# EAGLE design Infrarojo_01 (EAGLE 8.6.3)
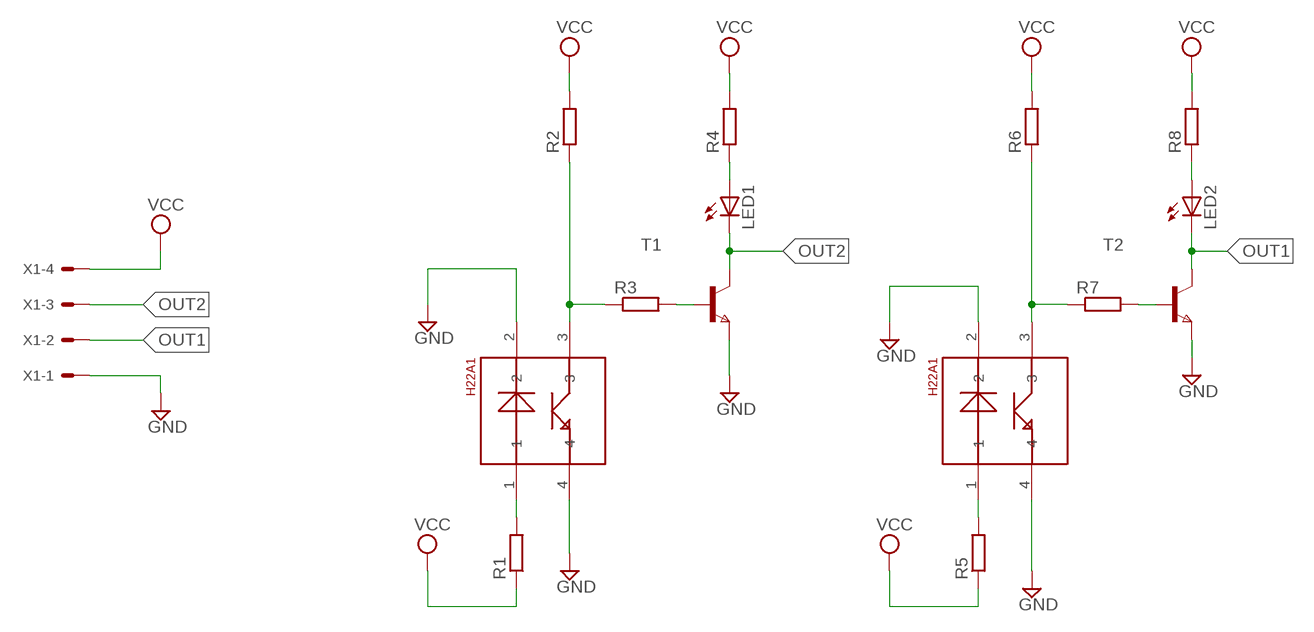
[diagram p0: schematic, sheet 1]

## Parts
IR1  IR1  H22A1  [H22A1]
IR2  IR2  H22A1  [H22A1]
LED1  LED3MM  [LED3MM]
LED2  LED3MM  [LED3MM]
R1  R-EU_R0805  [R0805]
R2  R-EU_R0805  [R0805]
R3  R-EU_R0805  [R0805]
R4  R-EU_R0805  [R0805]
R5  R-EU_R0805  [R0805]
R6  R-EU_R0805  [R0805]
R7  R-EU_R0805  [R0805]
R8  R-EU_R0805  [R0805]
T1  NPNSOT23  [SOT-23]
T2  NPNSOT23  [SOT-23]
X1  C-GRID-04-70543  [70543-04]

## Nets
GND: IR1.2 IR1.4 IR2.2 IR2.4 T1.2(E) T2.2(E) X1.1
N$1: IR1.1 R1.2
N$2: IR2.1 R5.2
N$3: IR1.3 R2.1 R3.1
N$4: R3.2 T1.3(B)
N$5: LED1.A R4.1
N$8: IR2.3 R6.1 R7.1
N$9: R7.2 T2.3(B)
N$11: LED2.A R8.1
OUT1: LED2.K(C) T2.1(C) X1.2
OUT2: LED1.K(C) T1.1(C) X1.3
VCC: R1.1 R2.2 R4.2 R5.1 R6.2 R8.2 X1.4

## Library data of the parts
IR1 IR2 = h22a1:H22A1
LED1 LED2 = led:LED: LED OSRAM: - CHIPLED LG R971, LG N971, LY N971, LG Q971, LY Q971, LO R971, LY R971 LH N974, LH R974 LS Q976, LO Q976, LY Q976 LO Q996 - Hyper CHIPLED LW Q18S LB Q993, LB Q99A, LB R99A - SideLED LS A670, LO A670, LY A670, LG A670, LP A670 LB A673, LV A673, LT A673, LW A673 LH A674 LY A675 LS A676, LA A676, LO A676, LY A676, LW A676 LS A679, LY A679, LG A679 - Hyper Micro SIDELED® LS Y876, LA Y876, LO Y876, LY Y876 LT Y87S - SmartLED LW L88C, LW L88S LB L89C, LB L89S, LG L890 LS L89K, LO L89K, LY L89K LS L896, LA L896, LO L896, LY L896 - TOPLED LS T670, LO T670, LY T670, LG T670, LP T670 LSG T670, LSP T670, LSY T670, LOP T670, LYG T670 LG T671, LOG T671, LSG T671 LB T673, LV T673, LT T673, LW T673 LH T674 LS T676, LA T676, LO T676, LY T676, LB T676, LH T676, LSB T676, LW T676 LB T67C, LV T67C, LT T67C, LS T67K, LO T67K, LY T67K, LW E67C LS E67B, LA E67B, LO E67B, LY E67B, LB E67C, LV E67C, LT E67C LW T67C LS T679, LY T679, LG T679 LS T770, LO T770, LY T770, LG T770, LP T770 LB T773, LV T773, LT T773, LW T773 LH T774 LS E675, LA E675, LY E675, LS T675 LS T776, LA T776, LO T776, LY T776, LB T776 LHGB T686 LT T68C, LB T68C - Hyper Mini TOPLED® LB M676 - Mini TOPLED Santana® LG M470 LS M47K, LO M47K, LY M47K Source: http://www.osram.convergy.de LUXEON: - LUMILED® LXK2-PW12-R00, LXK2-PW12-S00, LXK2-PW14-U00, LXK2-PW14-V00 LXK2-PM12-R00, LXK2-PM12-S00, LXK2-PM14-U00 LXK2-PE12-Q00, LXK2-PE12-R00, LXK2-PE12-S00, LXK2-PE14-T00, LXK2-PE14-U00 LXK2-PB12-K00, LXK2-PB12-L00, LXK2-PB12-M00, LXK2-PB14-N00, LXK2-PB14-P00, LXK2-PB14-Q00 LXK2-PR12-L00, LXK2-PR12-M00, LXK2-PR14-Q00, LXK2-PR14-R00 LXK2-PD12-Q00, LXK2-PD12-R00, LXK2-PD12-S00 LXK2-PH12-R00, LXK2-PH12-S00 LXK2-PL12-P00, LXK2-PL12-Q00, LXK2-PL12-R00 Source: www.luxeon.com KINGBRIGHT: KA-3528ASYC Source: www.kingbright.com
R1-R8 = rcl:R-EU_: RESISTOR, European symbol; SPICEPREFIX: R
T1 T2 = zetex:NPNSOT23: NPN TRANSISTOR; MPN: DSS20201L-7; OC_FARNELL: 1710688; OC_NEWARK: 25R4555
X1 = con-molex:C-GRID-04: CONNECTOR wire to board 2.54 mm (0.100") pitch header; MF: MOLEX; OC_FARNELL: unknown; OC_NEWARK: unknown

## Board
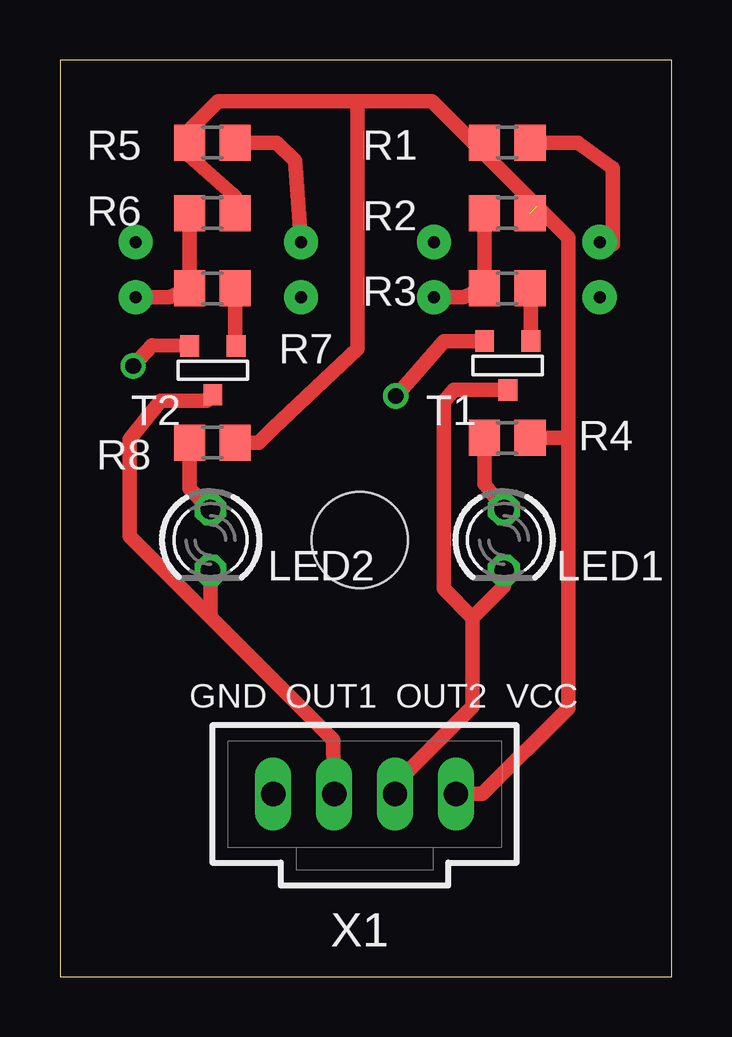
[diagram p1: board, top side]
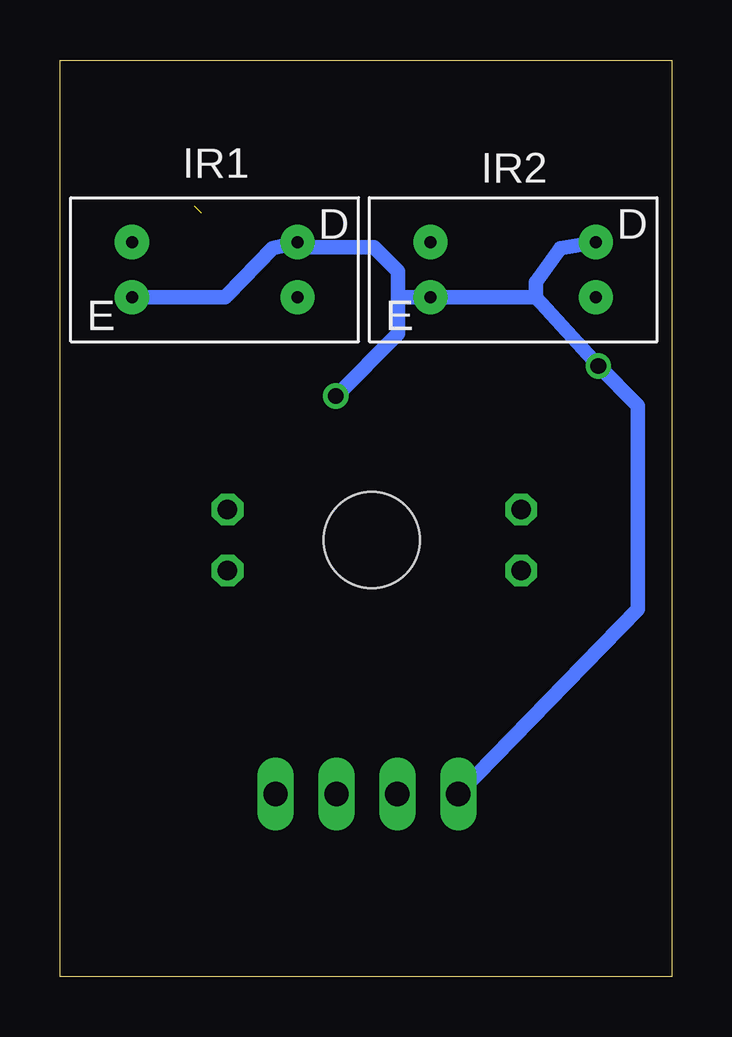
[diagram p2: board, bottom side, seen from below]

Size 25.5 x 38.2 mm. Coordinates in mm from the lower left corner, seen from the top.
Outline: 0,0 25.5,0 25.5,38.2 0,38.2 0,0
Copper layers (1*16): Top 0.035mm / dielectric 1.5mm / Bottom 0.035mm
Design rules "default": minimum track width 6mil, minimum drill 0.35mm, track to track 6mil, track to pad 6mil, pad to pad 6mil, via to via 6mil, smd to smd 6mil, copper to edge 40mil, drill to drill 6mil, minimum pad ring 10mil, minimum via ring 8mil, stop-mask expansion 4mil, vias tented up to drill 0mil, thermal gap 10mil
Holes 4 mm at 12.5,18.2

### Footprints (pad centres in the part's own frame; a part is rotated, then mirrored left to right if it is on the bottom)
H22A1 = drill 0.5 pad 1.422: 1 1.15,3.45; 2 -1.15,3.45; 3 -1.15,-3.45; 4 1.15,-3.45
LED3MM = drill 0.813 octagon: A -1.27,0; K 1.27,0
R0805 = smd 1.3 x 1.5: 1 -0.95,0; 2 0.95,0
SOT-23 = smd 0.787 x 0.889: 1 0.025,-1.016; 2 -0.94,1.016; 3 0.991,1.016
70543-04 = drill 1.016 long: 1 -3.81,0; 2 -1.27,0; 3 1.27,0; 4 3.81,0

### Placement (x,y rotation side)
IR1  19.05,29.46 90 bottom
IR2  6.6,29.46 90 bottom
LED1  18.51,18.2 270 top
LED2  6.28,18.2 270 top
R1  18.65,34.76 0 top
R2  18.65,31.82 0 top
R3  18.65,28.68 0 top
R4  18.65,22.46 0 top
R5  6.35,34.76 0 top
R6  6.35,31.82 0 top
R7  6.35,28.68 0 top
R8  6.35,22.26 0 top
T1  18.65,25.47 0 top
T2  6.35,25.27 0 top
X1  12.7,7.62 0 top

### Tracks (layer width: path | path; a pad name or v marks a point on that pad's centre or on a via)
GND  (via drill 0.65)
  Top 0.61: v3.05,25.45 3.83,26.31 T2.2 | v14,24.2 16.01,26.49 T1.2
  Bottom 0.2: 15.56,30.4 IR1.4
  Bottom 0.254: 11.34,28.31 11.4,28 | 18.62,28.31 18.54,28.4
  Bottom 0.61: X1.1 1.4,15.31 1.4,23.8 v3.05,25.45 5.66,28.31 | 5.66,28.31 IR2.2 11.34,28.31 | v14,24.2 11.4,26.8 11.4,28 11.4,29.4 12.4,30.4 15.56,30.4 | IR2.4 4.64,30.36 5.66,28.94 5.66,28.31 | IR1.4 16.64,30.36 18.54,28.4 | IR1.2 18.62,28.31
N$1
  Top 0.61: R1.2 21.59,34.76 23.06,33.69 23.06,30.52 IR1.1
N$2
  Top 0.61: R5.2 9.04,34.76 9.8,34 IR2.1
N$3
  Top 0.61: R2.1 R3.1 16.83,28.31 IR1.3
N$4
  Top 0.61: R3.2 19.64,28.64 T1.3
N$5
  Top 0.61: R4.1 17.7,20.54 LED1.A
N$8
  Top 0.61: R6.1 R7.1 4.58,28.31 IR2.3
N$9
  Top 0.2: 7.3,26.13 T2.3
  Top 0.61: R7.2 7.3,26.13
N$11
  Top 0.61: LED2.A 5.4,20.33 R8.1
OUT1
  Top 0.61: X1.2 11.38,9.77 11.38,9.88 6.28,14.98 | T2.1 6.12,24 4.2,24 2.91,22.41 2.91,18.35 6.28,14.98 | LED2.K 6.28,14.98
OUT2
  Top 0.61: T1.1 16.42,24.45 16,23.96 16,16.16 17.2,14.96 | 17.2,14.96 17.2,11.25 13.97,8.02 X1.3 | 17.2,14.96 18.51,16.28 LED1.K
VCC  (1 unrouted)
  Top 0.2: R6.2 7.3,31.9 | R1.1 18.1,34.2 18.2,34.2
  Top 0.254: 7.3,32.5 7.2,32.6
  Top 0.61: 21.2,22.47 21.2,30.8 20.18,31.82 | 21.2,22.47 21.2,11.2 17.62,7.62 X1.4 | 7.2,32.6 5.4,34.2 R5.1 5.4,35.28 6.6,36.48 12.4,36.48 | 12.4,36.48 12.4,26.16 8.89,22.86 8.29,22.26 R8.2 | 12.4,36.48 15.52,36.48 17.24,34.76 | R6.2 7.3,32.5 | R4.2 19.66,22.47 21.2,22.47 | 19.62,31.8 R2.2 20.18,31.82 | 17.7,34.3 R1.1 17.24,34.76 | 19.88,32.1 19.9,32.1 | 20.18,31.82 17.24,34.76

### Text on the board
tNames: GND | OUT1 | OUT2 | VCC